# Altium schematic sheet SwitchBypassWaveyRadar.SchDoc: Switch Bypass WaveyRadar Schematic
size Letter; Author: Will Vu; CompanyName: Raccoon Wireless; DrawnBy: Will Vu, Raccoon Wireless; Engineer: Will Vu; Organization: Raccoon Wireless; DocumentNumber: 2-07; Revision: 2; SheetNumber: 7; SheetTotal: 15
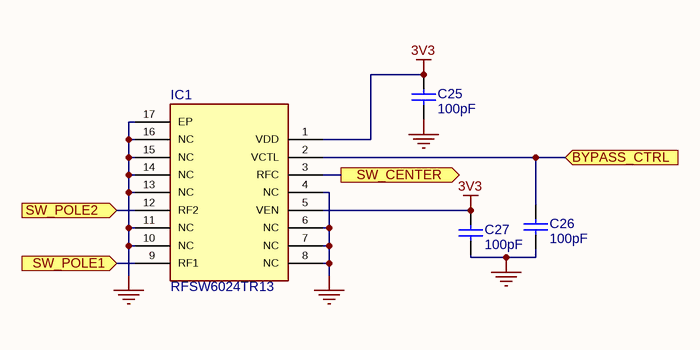
[diagram p0: SwitchBypassWaveyRadar.SchDoc]

## Parts
C25  value 100pF  [CAPC1005X56X25LL10T15]  (hidden comment: 04023A101JAT2A)
C26  value 100pF  [CAPC1005X56X25LL10T15]  (hidden comment: 04023A101JAT2A)
C27  value 100pF  [CAPC1005X56X25LL10T15]  (hidden comment: 04023A101JAT2A)
IC1  RFSW6024TR13  [QFN65P400X400X90-17N]

## Ports
BYPASS_CTRL (in), SW_CENTER (out), SW_POLE1 (in), SW_POLE2 (in)

## Nets
3V3: C25.2 C27.1 IC1.1(VDD) IC1.5(VEN)
GND: C25.1 C26.2 C27.2 IC1.4(NC) IC1.6(NC) IC1.7(NC) IC1.8(NC) IC1.10(NC) IC1.11(NC) IC1.13(NC) IC1.14(NC) IC1.15(NC) IC1.16(NC) IC1.17(EP)
BYPASS_CTRL: C26.1 IC1.2(VCTL) ; port BYPASS_CTRL
SW_CENTER: IC1.3(RFC) ; port SW_CENTER
SW_POLE1: IC1.9(RF1) ; port SW_POLE1
SW_POLE2: IC1.12(RF2) ; port SW_POLE2

## Notes on the sheet
- /

## Library data of the parts
C25-C27 = CMP-001-00083-2: AVX - 04023A101JAT2A - SMD Multilayer Ceramic Capacitor, 100 pF, 25 V, 0402 [1005 Metric], ± 5%, C0G / NP0, AVX 0402 MLCC
IC1 = CMP-023-000002-3: Integrated Circuit; Manufacturer_Name: Qorvo; Height: 0.9mm; Source: SamacSys.SchLib; Mouser2 Price/Stock: https://www.mouser.com/Search/Refine.aspx?Keyword=772-RFSW6024TR13; Datasheet Link: https://componentsearchengine.com//RFSW6024TR13.pdf; Design Item ID: RFSW6024TR13; Mouser2 Part Number: 772-RFSW6024TR13; Manufacturer_Part_Number: RFSW6024TR13